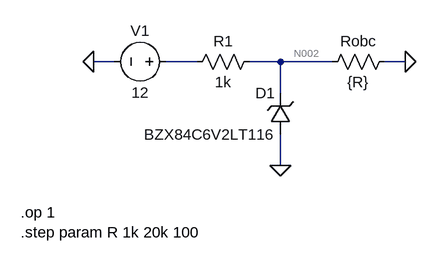
[diagram p0: schematic Zener.asc]
Zener.asc, the LTspice schematic file:
Version 4
SHEET 1 880 680
WIRE 32 64 0 64
WIRE 160 64 112 64
WIRE 288 64 240 64
WIRE 368 64 288 64
WIRE 480 64 448 64
WIRE 288 112 288 64
WIRE 288 224 288 176
FLAG 0 64 0
FLAG 288 224 0
FLAG 480 64 0
SYMBOL voltage 128 64 R90
WINDOW 0 -32 56 VBottom 2
WINDOW 3 32 56 VTop 2
WINDOW 123 0 0 Left 0
WINDOW 39 0 0 Left 0
SYMATTR InstName V1
SYMATTR Value 12
SYMBOL res 256 48 R90
WINDOW 0 0 56 VBottom 2
WINDOW 3 32 56 VTop 2
SYMATTR InstName R1
SYMATTR Value 1k
SYMBOL res 464 48 R90
WINDOW 0 0 56 VBottom 2
WINDOW 3 32 56 VTop 2
SYMATTR InstName Robc
SYMATTR Value {R}
SYMBOL zener 304 176 R180
WINDOW 0 24 64 Left 2
WINDOW 3 24 0 Left 2
SYMATTR InstName D1
SYMATTR Value BZX84C6V2LT116
TEXT -112 296 Left 2 !.op 1\n.step param R 1k 20k 100

The netlist it stands for:
* Zener.asc
V1 N001 0 12
R1 N002 N001 1k
Robc 0 N002 {R}
D1 0 N002 BZX84C6V2LT116
.model D D
.lib standard.dio
.op 1
.step param R 1k 20k 100
.backanno
.end

* Results of the author's LTspice run, read from the files saved beside the schematic
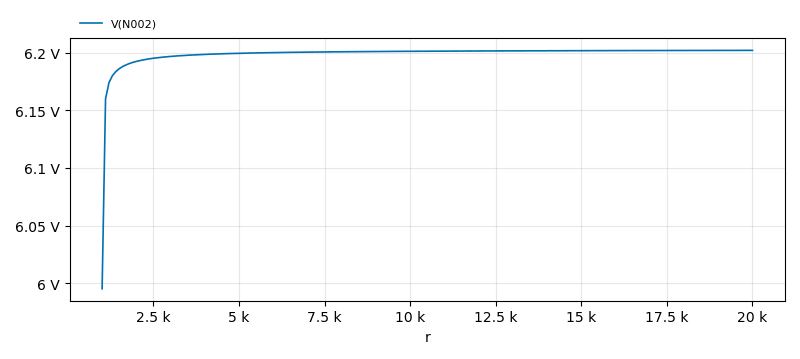
[diagram p1: Operating Point of Zener.asc, plotted from the saved traces]
* Operating Point, 1 run:
*   V(N002): 5.995 V at r=1 k, 6.202 V at r=20 k, min 5.995 V, max 6.202 V
* From the log:
*   Semiconductor Device Operating Points:
*                           --- Diodes ---
*   Name:        d1
*   Model: bzx84c6v2lt116
*   Id:      -9.74e-06
*   Vd:      -6.00e+00
*   Req:      2.92e+04
*   CAP:      1.78e-11